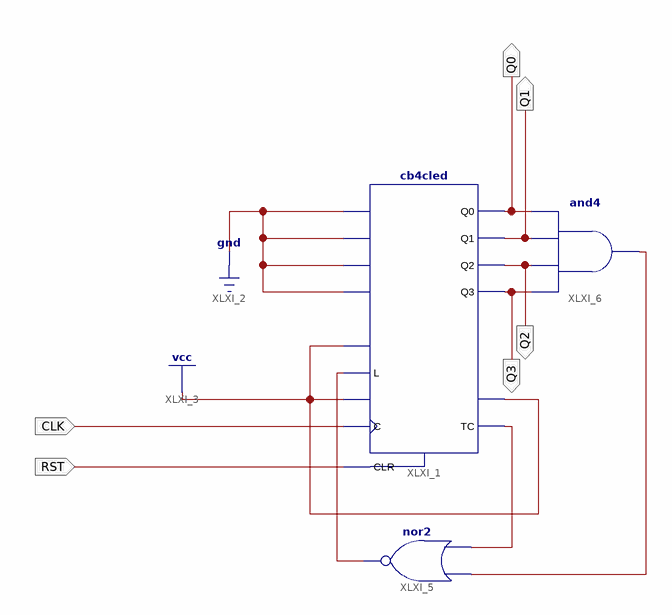
[diagram p0: schematic sheet 1]
// Xilinx ISE schematic p3ej2.sch (spartan3) as structural Verilog: 3 symbols, 6 ports
module p3ej2 (
  input  CLK,
  input  RST,
  output Q0,
  output Q1,
  output Q2,
  output Q3
);

  wire XLXN_12, XLXN_13, XLXN_14;

  cb4cled XLXI_1 (
    .C(CLK), .CE(1'b1), .CLR(RST), .D0(1'b0), .D1(1'b0), .D2(1'b0), .D3(1'b0), .L(XLXN_12), .UP(1'b1),
    .CEO(1'b1), .Q0(Q0), .Q1(Q1), .Q2(Q2), .Q3(Q3), .TC(XLXN_13));
  nor XLXI_5 (XLXN_12, XLXN_13, XLXN_14);
  and XLXI_6 (XLXN_14, Q3, Q2, Q1, Q0);
endmodule
